# EasyEDA schematic Double Soil Moisture Feather Shield.json
TITLE: Sheet_1; REV: 1.1; Date: 2023-03-01; Sheet: 1/1; Drawn By: Carlos Vidal; Company: LiU
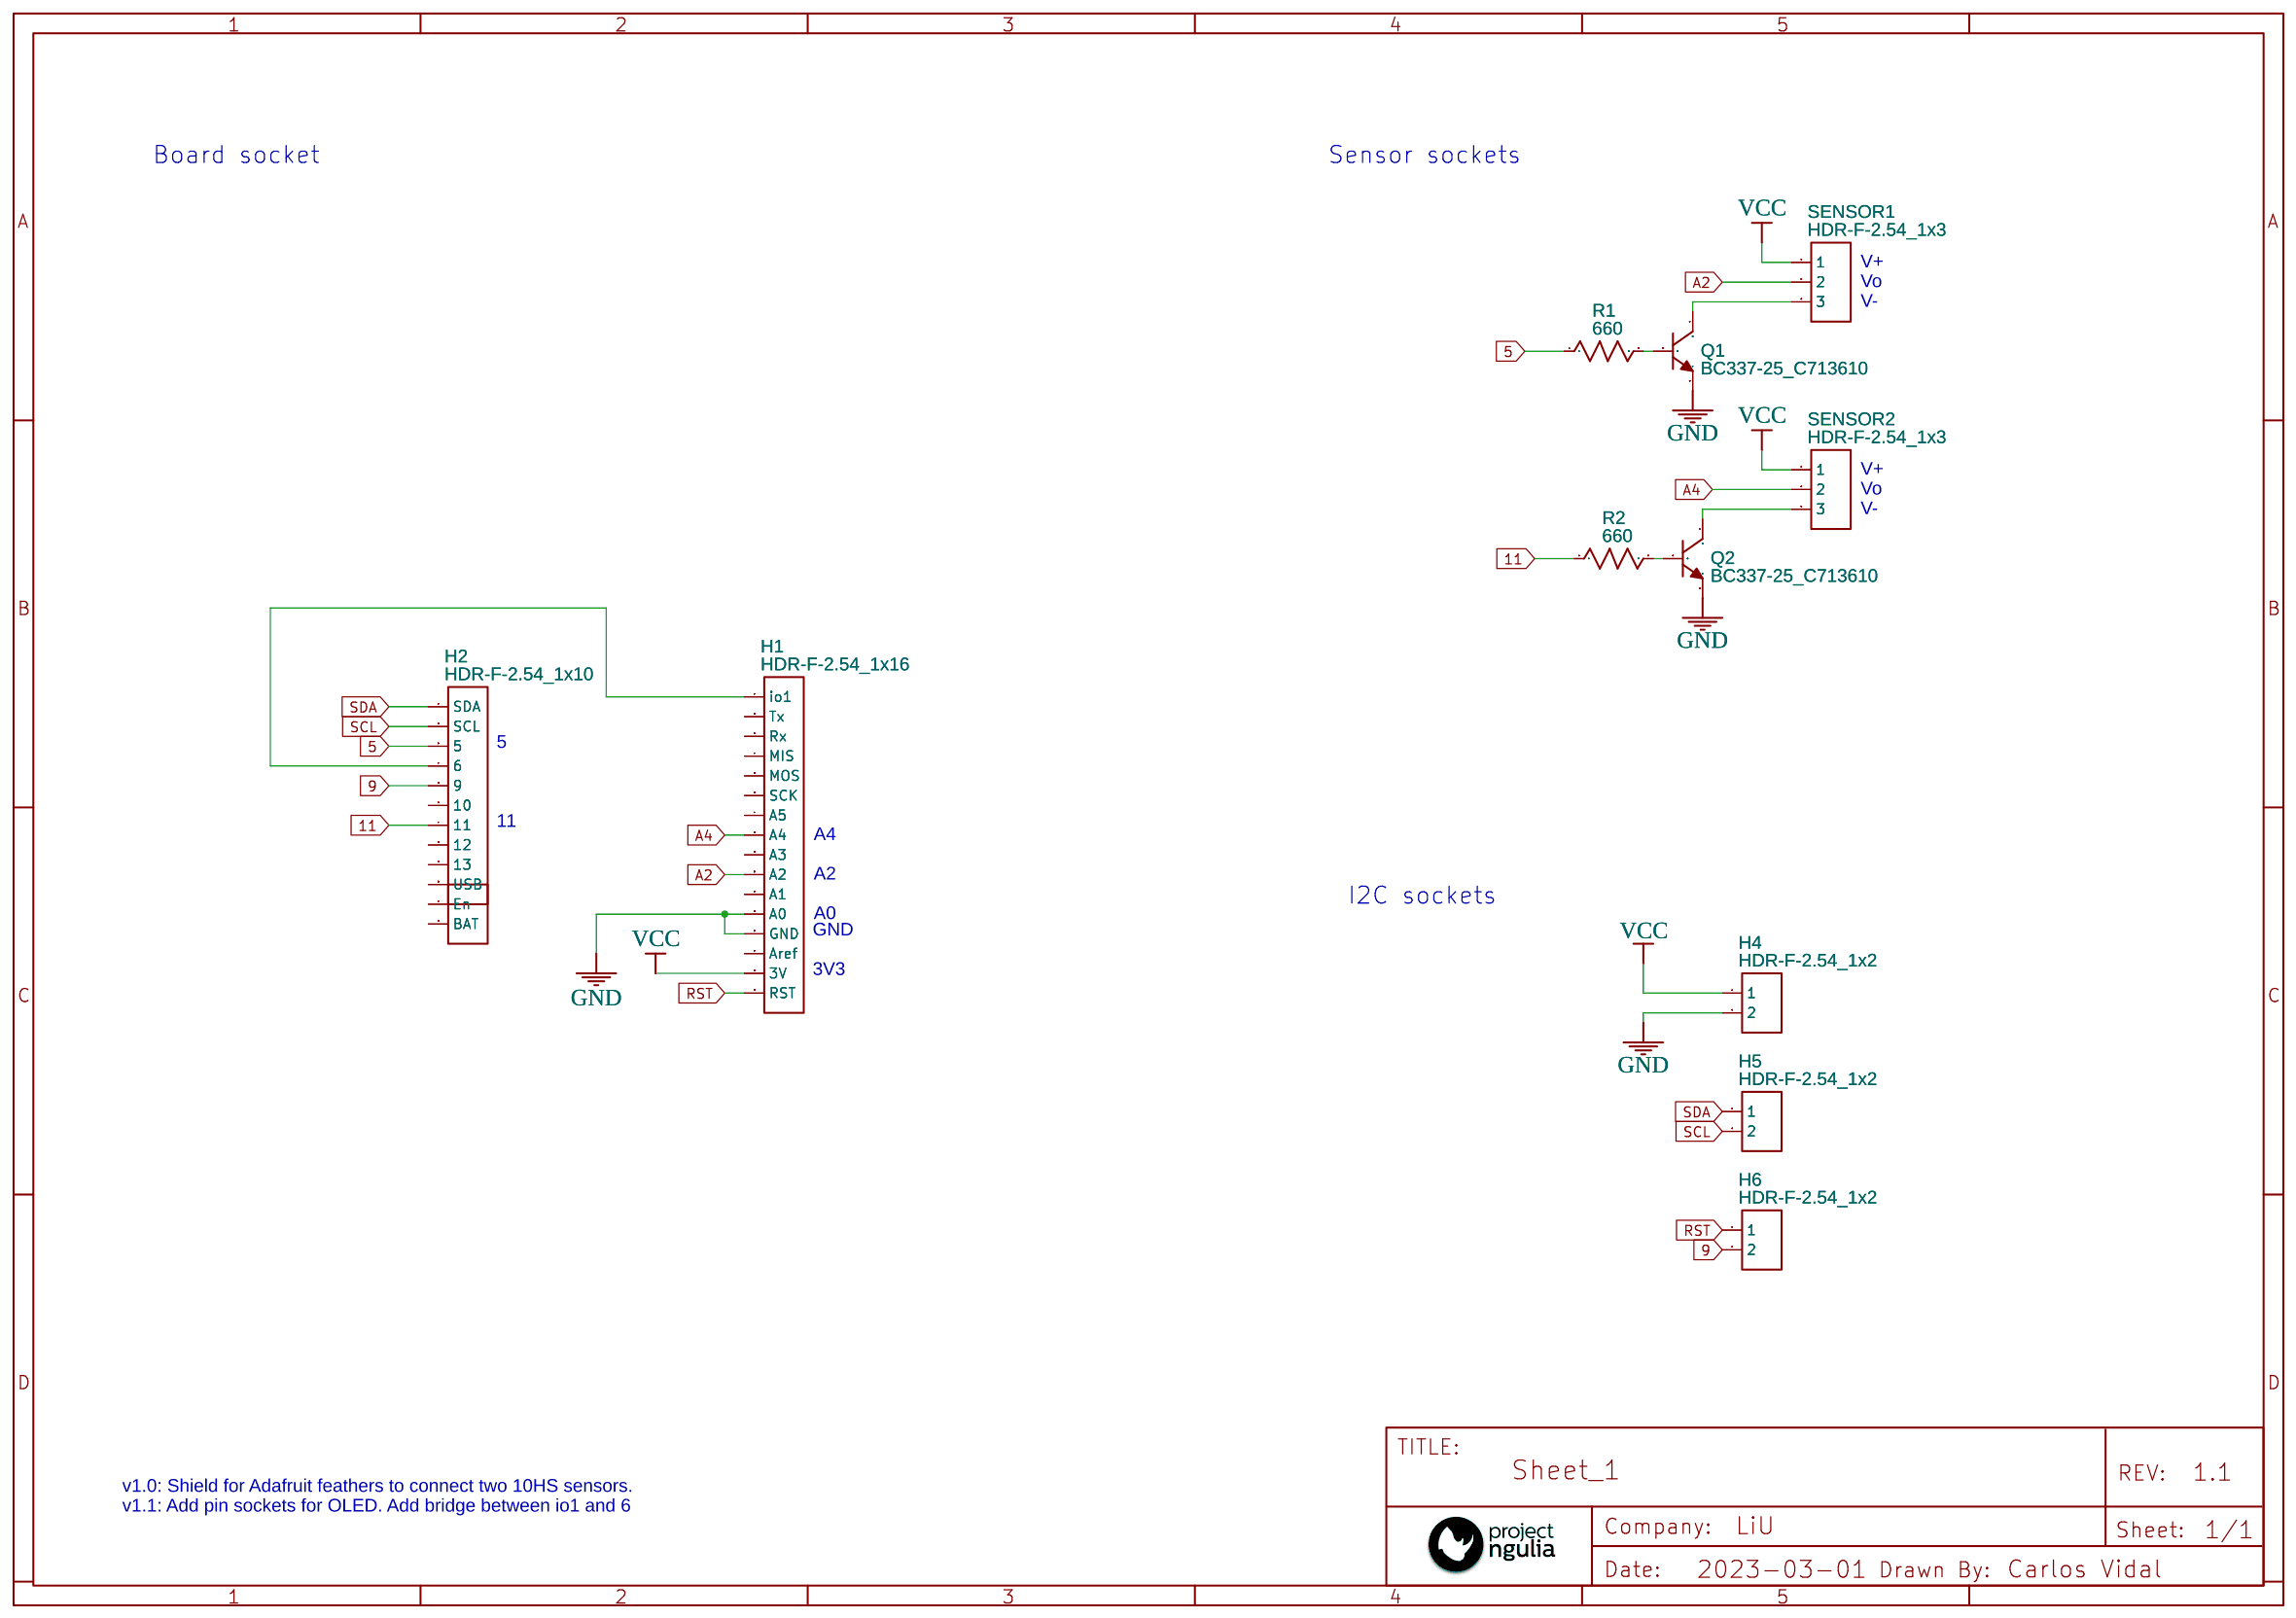
[diagram p0: schematic sheet]

## Parts
H1  HDR-F-2.54_1x16  [HDR-F-2.54_1X16]
H2  HDR-F-2.54_1x10  [HDR-F-2.54_1X10]
H3  HDR-F-2.54_1x2  [HDR-F-2.54_1X2]
H4  HDR-F-2.54_1x2  [HDR-F-2.54_1X2]
H5  HDR-F-2.54_1x2  [HDR-F-2.54_1X2]
H6  HDR-F-2.54_1x2  [HDR-F-2.54_1X2]
Q1  BC337-25_C713610  [TO-92-3_L4.9-W3.7-P1.27-L]
Q2  BC337-25_C713610  [TO-92-3_L4.9-W3.7-P1.27-L]
R1  660  [R0603]
R2  660  [R0603]
SENSOR1  HDR-F-2.54_1x3  [HDR-F-2.54_1X3]
SENSOR2  HDR-F-2.54_1x3  [HDR-F-2.54_1X3]

## Library data of the parts
H1 = HDR-F-2.54_1x16: Supplier Part: C66987; Supplier: LCSC; Contributor: LCEDA_Lib
H2 = HDR-F-2.54_1x10: Supplier Part: C35445; Supplier: LCSC; Contributor: LCEDA_Lib
H3-H6 = HDR-F-2.54_1x2: Supplier Part: C49661; Supplier: LCSC; Contributor: LCEDA_Lib
Q1 Q2 = BC337-25_C713610: Supplier: LCSC; Supplier Part: C713610; Manufacturer: LGE(鲁光); Manufacturer Part: BC337-25; Contributor: LCSC; JLCPCB Part Class: Extended Part
R1 R2 = R_0603_US: Contributor: LCEDA_Lib
SENSOR1 SENSOR2 = HDR-F-2.54_1x3: Supplier Part: C146690; Supplier: LCSC; Contributor: LCEDA_Lib

## Nets
GND: H1.12(A0) H1.13(GND) H4.2 Q1.3(E) Q2.3(E)
VCC: H1.15(3V) H4.1 SENSOR1.1 SENSOR2.1
5: H2.3(5) R1.1
9: H2.5(9) H6.2
11: H2.7(11) R2.1
A2: H1.10(A2) SENSOR1.2
A4: H1.8(A4) SENSOR2.2
RST: H1.16(RST) H6.1
SCL: H2.2(SCL) H5.2
SDA: H2.1(SDA) H5.1
Net-(H1-1): H1.1(io1) H2.4(6)
Net-(Q1-1): Q1.1(C) SENSOR1.3
Net-(Q1-2): Q1.2(B) R1.2
Net-(Q2-1): Q2.1(C) SENSOR2.3
Net-(Q2-2): Q2.2(B) R2.2

Not connected (* = marked no-connect by the designer): H1 2(Tx) 3(Rx) 4(MIS) 5(MOS) 6(SCK) 7(A5) 9(A3) 11(A1) 14(Aref); H2 6(10) 8(12) 9(13) 10(USB); H3 1(En) 2(BAT)

## Notes on the sheet
- Board socket
- Sensor sockets
- V+
- Vo
- V-
- V+
- Vo
- V-
- 5
- 11
- A4
- A2
- I2C sockets
- A0
- GND
- 3V3
- v1.0: Shield for Adafruit feathers to connect two 10HS sensors.
- v1.1: Add pin sockets for OLED. Add bridge between io1 and 6
